# Altium schematic sheet POWER.SchDoc
size A4
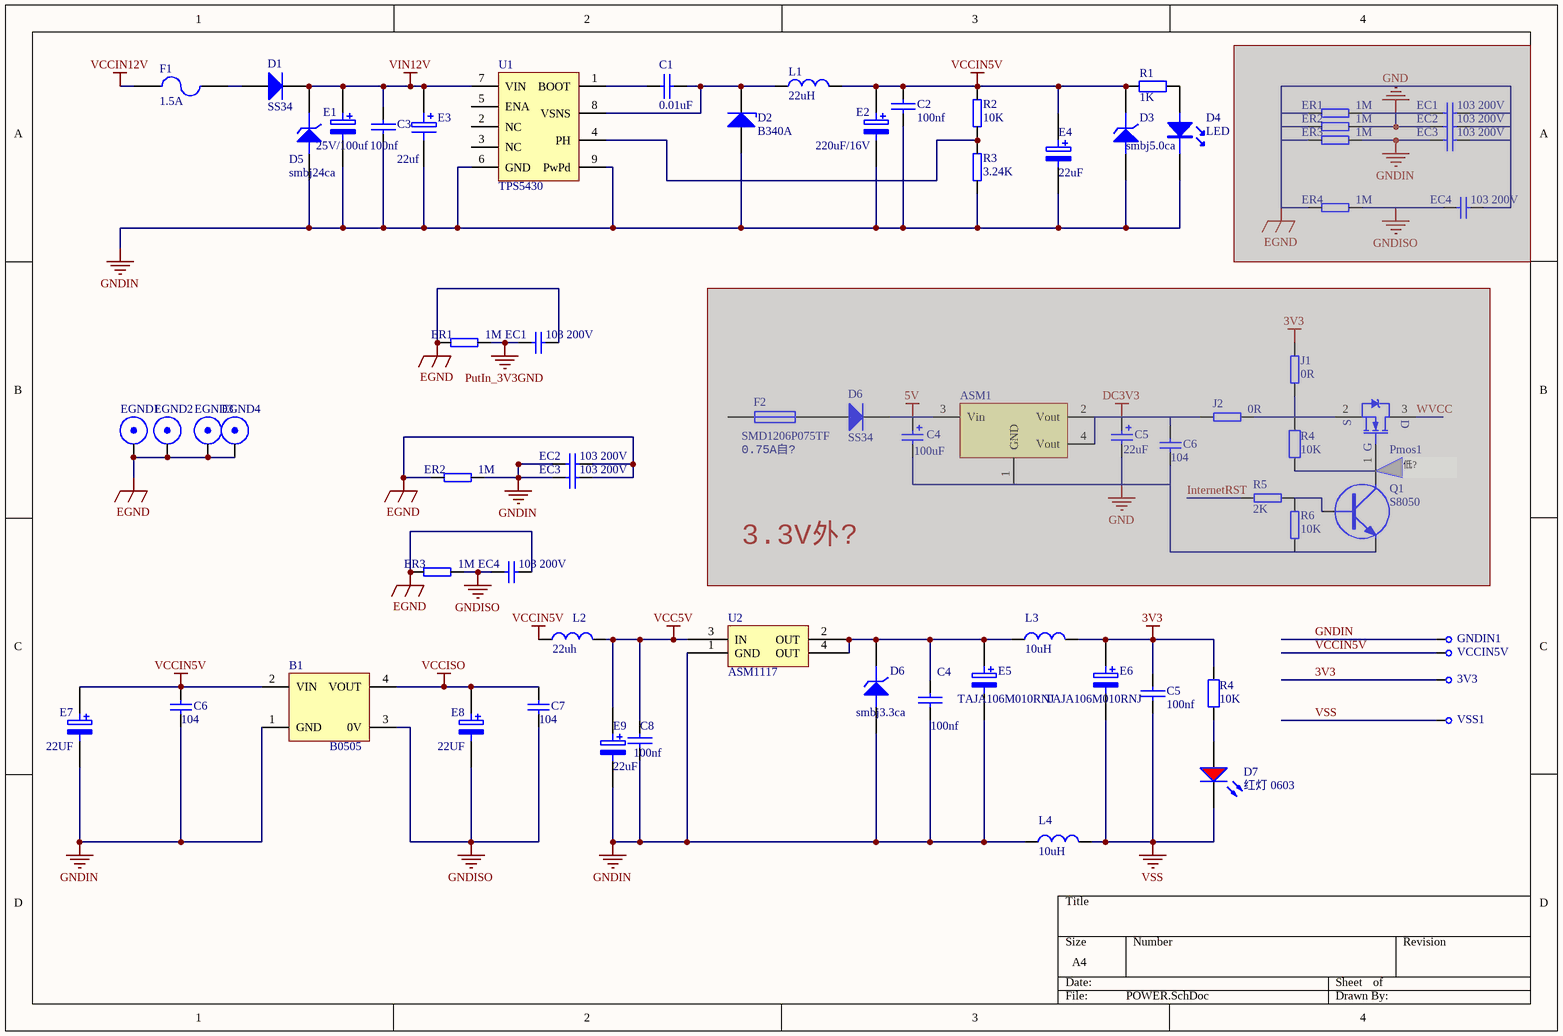
[diagram p0: POWER.SchDoc]

## Parts
(Parts that share a designator on the sheet are numbered #1, #2 ... from top to bottom, then left to right.)
3V3  CHECK  [CHECK-B]  (value not drawn)
ASM1  ASM1117-3.3  [LC-SOT-223]  (value not drawn)  (masked out: inside a compile mask, not in the netlist)
B1  B0505  [B0505D-1WR2]
C1  0.01uF  [LC-1206_C]
C2  100nf  [LC-0603_C]
C3  100nf  [LC-0603_C]
C4#1  100uF  [HONOR_63X54]  (masked out: inside a compile mask, not in the netlist)
C4#2  100nf  [LC-0603_C]
C5#1  22uF  [HONOR_63X54]  (masked out: inside a compile mask, not in the netlist)
C5#2  100nf  [LC-0603_C]
C6#1  104  [LC-0603_C]  (masked out: inside a compile mask, not in the netlist)
C6#2  104  [LC-0603_C]
C7  104  [LC-0603_C]
C8  100nf  [LC-0603_C]
D1  SS34  [LC-SMA(DO-214AC)_S1]
D2  value B340A  [LC-SMA(DO-214AC)_S1]  (hidden comment: Diode-Z)
D3  smbj5.0ca  [LC-SMB(DO-214AA)_S1]
D4  LED  [0603_LED_G]
D5  smbj24ca  [LC-SMB(DO-214AA)_S1]
D6#1  SS34  [LC-SMA(DO-214AC)_S5]  (masked out: inside a compile mask, not in the netlist)
D6#2  smbj3.3ca  [LC-SMB(DO-214AA)_S1]
D7  红灯 0603  [LC-0603_LED_S1]
E1  25V/100uf  [C-RB-SD8]
E2  220uF/16V  [C-RB-SD6]
E3  22uf  [LC-CASE-B_3528]
E4  22uF  [LC-CASE-B_3528]
E5  TAJA106M010RNJ  [LC-CASE-A_3216]
E6  TAJA106M010RNJ  [LC-CASE-A_3216]
E7  22UF  [LC-CASE-B_3528]
E8  22UF  [LC-CASE-B_3528]
E9  22uF  [LC-CASE-B_3528]
EC1#1  103 200V  [LC-1206_C]  (masked out: inside a compile mask, not in the netlist)
EC1#2  103 200V  [LC-1206_C]
EC2#1  103 200V  [LC-1206_C]  (masked out: inside a compile mask, not in the netlist)
EC2#2  103 200V  [LC-1206_C]
EC3#1  103 200V  [LC-1206_C]  (masked out: inside a compile mask, not in the netlist)
EC3#2  103 200V  [LC-1206_C]
EC4#1  103 200V  [LC-1206_C]  (masked out: inside a compile mask, not in the netlist)
EC4#2  103 200V  [LC-1206_C]
EGND1  EGND  [H-6-3.2m]  (value not drawn)
EGND2  EGND  [H-6-3.2m]  (value not drawn)
EGND3  EGND  [H-6-3.2m]  (value not drawn)
EGND4  EGND  [H-6-3.2m]  (value not drawn)
ER1#1  1M  [LC-1206_R]  (masked out: inside a compile mask, not in the netlist)
ER1#2  1M  [LC-1206_R]
ER2#1  1M  [LC-1206_R]  (masked out: inside a compile mask, not in the netlist)
ER2#2  1M  [LC-1206_R]
ER3#1  1M  [LC-1206_R]  (masked out: inside a compile mask, not in the netlist)
ER3#2  1M  [LC-1206_R]
ER4  1M  [LC-1206_R]  (masked out: inside a compile mask, not in the netlist)
F1  value 1.5A  [1812]  (hidden comment: Fuse2)
F2  SMD1206P075TF  [LC-1206_R]  (masked out: inside a compile mask, not in the netlist)
GNDIN1  CHECK  [CHECK-B]  (value not drawn)
J1  0R  [LC-0603_L]  (masked out: inside a compile mask, not in the netlist)
J2  0R  [LC-0603_L]  (masked out: inside a compile mask, not in the netlist)
L1  value 22uH  [L-SMD-7]  (hidden comment: Inductor)
L2  22uh  [L-SMD-3012]
L3  value 10uH  [LC-0805_L]  (hidden comment: Inductor)
L4  value 10uH  [LC-0805_L]  (hidden comment: Inductor)
Pmos1  SI2301  [LC-SOT-23(SOT-23-3)]  (value not drawn)  (masked out: inside a compile mask, not in the netlist)
Q1  S8050  [LC-SOT-23(SOT-23-3)]  (masked out: inside a compile mask, not in the netlist)
R1  1K  [LC-0603_R]
R2  10K  [LC-0603_R]
R3  3.24K  [LC-0603_R]
R4#1  10K  [LC-0603_R]  (masked out: inside a compile mask, not in the netlist)
R4#2  10K  [LC-0603_R]
R5  2K  [LC-0603_R]  (masked out: inside a compile mask, not in the netlist)
R6  10K  [LC-0603_R]  (masked out: inside a compile mask, not in the netlist)
U1  TPS5430  [TPS5430]
U2  ASM1117  [SOT223]
VCCIN5V  CHECK  [CHECK-B]  (value not drawn)
VSS1  CHECK  [CHECK-B]  (value not drawn)

## Nets
3V3: 3V3.1 C5#2.2 E6.1 L3.2 R4#2.1
EGND: EC1#2.1 EC2#2.1 EC3#2.1 EC4#2.1 EGND1.0 EGND2.0 EGND3.0 EGND4.0 ER1#2.1 ER2#2.1 ER3#2.1
GNDIN: B1.1(GND) C2.1 C3.1 C4#2.1 C6#2.2 C8.1 D2.1(A) D3.1(A) D4.K D5.1(A) D6#2.1(A) E1.2 E2.2 E3.2 E4.2 E5.2 E7.2 E9.2 EC2#2.2 EC3#2.2 ER2#2.2 GNDIN1.1 L4.1 R3.2 U1.6(GND) U1.9(PwPd) U2.1(GND)
GNDISO: B1.3(0V) C7.2 E8.2 EC4#2.2 ER3#2.2
PutIn_3V3GND: EC1#2.2 ER1#2.2
VCC5V: C8.2 E9.1 L2.2 U2.3(IN)
VCCIN5V: B1.2(VIN) C2.2 C6#2.1 D3.2(K) E2.1 E4.1 E7.1 L1.2 L2.1 R1.1 R2.2 VCCIN5V.1
VCCIN12V: F1.1
VCCISO: B1.4(VOUT) C7.1 E8.1
VIN12V: C3.2 D1.2(K) D5.2(K) E1.1 E3.1 U1.7(VIN)
VSS: C5#2.1 D7.K E6.2 L4.2 VSS1.1
NetC1_1: C1.1 D2.2(K) L1.1 U1.8(VSNS)
NetC1_2: C1.2 U1.1(BOOT)
NetC4#2_2: C4#2.2 D6#2.2(K) E5.1 L3.1 U2.2(OUT) U2.4(OUT)
NetD1_1: D1.1(A) F1.2
NetD4_A: D4.A R1.2
NetD7_A: D7.A R4#2.2
NetR2_1: R2.1 R3.1 U1.4(PH)

Not connected (* = marked no-connect by the designer): U1 2(NC) 3(NC) 5(ENA)

## Notes on the sheet
- (near F2) 0.75A自?
- 低?
- 3.3V外?

## Library data of the parts
3V3 = CHE: 测试点
ASM1 = VOLTREG1
C1-C3 C4#2 C5#2 C8 = CAP: Capacitor
C4#1 C5#1 = Cap Pol1: Polarized Capacitor (Radial); Published: 8-Jun-2000; Revision: July-2002: Re-released for DXP Platform.; Publisher: Altium Limited
  C4#1: Value: 100uF
  C5#1: Value: 22uF
C6#1 C6#2 C7 = Cap: Capacitor; Value: 100nF; Published: 8-Jun-2000; Revision: July-2002: Re-released for DXP Platform.; Publisher: Altium Limited
D1 = D: 二极管; Published: 8-Jun-2000; LatestRevisionDate: 17-Jul-2002; LatestRevisionNote: Re-released for DXP Platform.; PackageDocument: Sep-1996; PackageReference: SMC; Publisher: Altium Limited; Code_JEDEC: DO-214-AB
D2 = Dio: 稳压二极管; Published: 8-Jun-2000; LatestRevisionDate: 17-Jul-2002; LatestRevisionNote: Re-released for DXP Platform.; PackageReference: SMB; Publisher: Altium Limited; Code_JEDEC: DO-214-AA
D3 D5 D6#2 = ZENER3: Zener Diode
D6#1 = Diode: Default Diode; Published: 8-Jun-2000; LatestRevisionDate: 17-Jul-2002; LatestRevisionNote: Re-released for DXP Platform.; PackageDocument: Sep-1996; PackageReference: SMC; Publisher: Altium Limited; Code_JEDEC: DO-214-AB
D7 = 0603 红灯: 发光二极管; ComponentLink1Des: 供应商链接; ComponentLink1URL: http://www.szlcsc.com/product/details_2659.html; Package: 0603; Supplier: LC; SuppliersPartNumber: C2286
E1 E2 E4-E9 = ELECTRO2: Electrolytic Capacitor
E3 = ELECTRO1: Electrolytic Capacitor
EC1#1 EC1#2 EC2#1 EC2#2 EC3#1 EC3#2 EC4#1 EC4#2 = Cap: Capacitor; Value: 103; Published: 8-Jun-2000; Revision: July-2002: Re-released for DXP Platform.; Publisher: Altium Limited
ER1#1 ER1#2 ER2#1 ER2#2 ER3#1 ER3#2 ER4 R2 R3 = RES2
F1 = Fuse2: 可恢复保险丝; Published: 8-Jun-2000; LatestRevisionDate: 17-Jul-2002; LatestRevisionNote: Re-released for DXP Platform.; PackageReference: PIN-W2/E2.8; Publisher: Altium Limited
F2 = Fuse 1: Fuse; Published: 8-Jun-2000; LatestRevisionDate: 17-Jul-2002; LatestRevisionNote: Re-released for DXP Platform.; PackageReference: PIN-W2/E2.8; Publisher: Altium Limited
GNDIN1 VCCIN5V VSS1 = C: 测试点
J1 J2 R5 R6 = RES
L1 L3 L4 = Ind: 电感; Code_IEC: 1005; Published: 8-Jun-2000; LatestRevisionDate: 17-Jul-2002; LatestRevisionNote: Re-released for DXP Platform.; PackageReference: 0402-A; Publisher: Altium Limited; Code_JEITA: 0402
L2 = Ind: 电感; Code_IEC: 1005; Value: 10uH; Published: 8-Jun-2000; LatestRevisionDate: 17-Jul-2002; LatestRevisionNote: Re-released for DXP Platform.; PackageReference: 0402-A; Publisher: Altium Limited; Code_JEITA: 0402
Pmos1 = N-MOS
Q1 = NPN
R1 R4#1 = Res2: Resistor; Published: 8-Jun-2000; LatestRevisionDate: 17-Jul-2002; LatestRevisionNote: Re-released for DXP Platform.; PackageReference: AXIAL-0.4; Publisher: Altium Limited
  R1: Value: 1K
  R4#1: Value: 10K
R4#2 = Res2: Resistor; Value: 1K; Published: 8-Jun-2000; LatestRevisionDate: 17-Jul-2002; LatestRevisionNote: Re-released for DXP Platform.; PackageReference: AXIAL-0.4; Publisher: Altium Limited
U2 = ASM1: 3.3V稳压芯片